# EAGLE schematic Analog_Pushbutton3 (EAGLE 9.6.2)
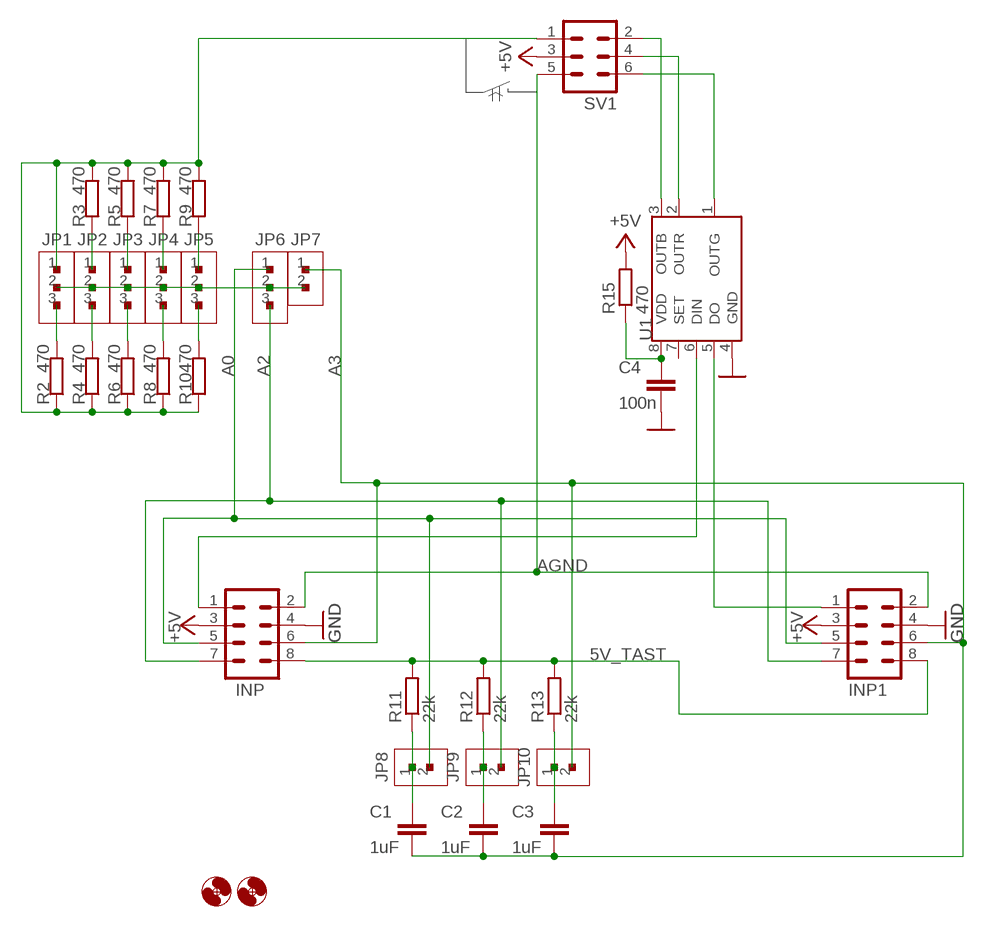
[diagram p0: schematic, sheet 1]

## Parts
C1  1uF  C-EUC0603  [C0603]
C2  1uF  C-EUC0603  [C0603]
C3  1uF  C-EUC0603  [C0603]
C4  100n  C-EUC0603  [C0603]
H1  MOUNT-HOLE3.0  [3,0]
H2  MOUNT-HOLE3.0  [3,0]
INP  CON-HARTING-ML_ML08  [CON-HARTING-ML_ML08]
INP1  CON-HARTING-ML_ML08  [CON-HARTING-ML_ML08]
JP1  PINHD-1X3CB  [1X03-CLEANBIG]
JP2  PINHD-1X3CB  [1X03-CLEANBIG]
JP3  PINHD-1X3CB  [1X03-CLEANBIG]
JP4  PINHD-1X3CB  [1X03-CLEANBIG]
JP5  PINHD-1X3CB  [1X03-CLEANBIG]
JP6  PINHD-1X3CB  [1X03-CLEANBIG]
JP7  PINHD-1X2  [1X02]
JP8  PINHD-1X2  [1X02]
JP9  PINHD-1X2  [1X02]
JP10  PINHD-1X2  [1X02]
R2  470  R-EU_R0603  [R0603]
R3  470  R-EU_R0603  [R0603]
R4  470  R-EU_R0603  [R0603]
R5  470  R-EU_R0603  [R0603]
R6  470  R-EU_R0603  [R0603]
R7  470  R-EU_R0603  [R0603]
R8  470  R-EU_R0603  [R0603]
R9  470  R-EU_R0603  [R0603]
R10  470  R-EU_R0603  [R0603]
R11  22k  R-EU_R0603  [R0603]
R12  22k  R-EU_R0603  [R0603]
R13  22k  R-EU_R0603  [R0603]
R15  470  R-EU_R0603  [R0603]
SV1  CON-HARTING-ML_ML6  [CON-HARTING-ML_ML6]
U1  S3PO_MODUL_WS2811_SOUND_MP3-TF-16P_WS2811_AND_ATTINY_WS2811-ICSOP8  [SOP8]

## Nets
5V_TAST: INP1.8 INP.8 R11.2 R12.2 R13.2
+5V: INP1.3 INP.3 R15.2 SV1.3
A0: INP1.5 INP.5 JP6.1 JP8.2
A2: INP1.7 INP.7 JP6.3 JP9.2
A3: C1.2 C2.2 C3.2 INP1.6 INP.6 JP7.1 JP10.2
AGND: INP1.2 INP.2 SV1.5
GND: C4.2 INP1.4 INP.4 U1.4(GND)
N$1: SV1.4 U1.2(OUTR)
N$2: SV1.6 U1.1(OUTG)
N$3: SV1.2 U1.3(OUTB)
N$4: INP.1 U1.6(DIN)
N$5: INP1.1 U1.5(DO)
N$6: C1.1 JP8.1 R11.1
N$7: JP1.3 R2.2
N$8: JP1.1 R2.1 R3.2 R4.1 R5.2 R6.1 R7.2 R8.1 R9.2 R10.1 SV1.1
N$9: JP2.3 R4.2
N$10: JP2.1 R3.1
N$11: JP3.3 R6.2
N$12: JP3.1 R5.1
N$13: JP4.3 R8.2
N$14: JP4.1 R7.1
N$15: JP5.3 R10.2
N$16: JP5.1 R9.1
N$17: C2.1 JP9.1 R12.1
N$18: C3.1 JP10.1 R13.1
N$21: JP1.2 JP2.2 JP3.2 JP4.2 JP5.2 JP6.2 JP7.2
N$76: C4.1 R15.1 U1.8(VDD)
Unconnected: U1.7(SET)

## Library data of the parts
C1-C4 = rcl:C-EU: CAPACITOR, European symbol; SPICEPREFIX: C
H1 H2 = holes:MOUNT-HOLE: MOUNTING HOLE with drill center marker
INP INP1 = PushButtonAction_4017_2:CON-HARTING-ML_ML08: Modified by Hardi; OC_FARNELL: unknown; OC_NEWARK: unknown
JP1-JP6 = adafruit:PINHD-1X3: PIN HEADER
JP7-JP10 = adafruit:PINHD-1X2: PIN HEADER
R2-R13 R15 = rcl:R-EU_: RESISTOR, European symbol; SPICEPREFIX: R
SV1 = PushButtonAction_4017_4:CON-HARTING-ML_ML6: HARTING; OC_FARNELL: unknown; OC_NEWARK: unknown
U1 = S3PO_Modul_WS2811:S3PO_MODUL_WS2811_SOUND_MP3-TF-16P_WS2811_AND_ATTINY_WS2811-IC: Die Pin Nummern für R und G sind getauscht damit sie gleich angesteuert werden wie die WS2812. Der Daten Strom der WS2811 ist RGB, Beim WS2812 ist es aber GRB.